# Altium schematic sheet SD CARD.SchDoc: microSD Interface
size A4; CompanyName: Atrotech; DrawnBy: Parsa Malekpour; Organization: Atrotech co.; Address1: +98 9036922999; Address2: atrotech.ir; DocumentNumber: 8; Revision: 1.0; SheetNumber: 8; SheetTotal: 10
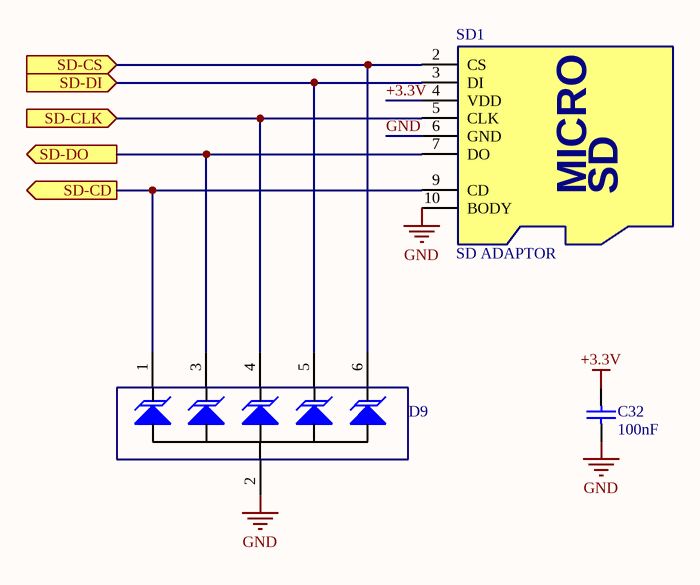
[diagram p0: SD CARD.SchDoc]

## Parts
C32  100nF  [C603]
D9  SMF05C  [SOT-363]  (value not drawn)
SD1  SD ADAPTOR  [MICRO-SD]

## Ports
SD-CD (out), SD-CLK (in), SD-CS (in), SD-DI (in), SD-DO (out)

## Nets
+3.3V: C32.2 SD1.4(VDD)
GND: C32.1 D9.2(A) SD1.6(GND) SD1.10(BODY)
SD-CD: D9.1(K) SD1.9(CD) ; port SD-CD
SD-CLK: D9.4(K) SD1.5(CLK) ; port SD-CLK
SD-CS: D9.6(K) SD1.2(CS) ; port SD-CS
SD-DI: D9.5(K) SD1.3(DI) ; port SD-DI
SD-DO: D9.3(K) SD1.7(DO) ; port SD-DO

Not connected (* = marked no-connect by the designer): SD1 1(DAT2) 8(DAT1)

## Notes on the sheet
- Title
- Size:
- Date:
- A4
- Number:
- Time:
- Revision:
- Sheet
- of
- Atrotech co.
- www.atrotech.ir <http://www.atrotech.ir>
- +98 90 369 22 999
- Tehran
- IRAN
- File:
- (in symbol uSD) MICRO; SD

## Library data of the parts
C32 = Cap: Capacitor; Designer: Parsa Malekpour; Value: 100nF
D9 = SMF05C: TVS Diode Array  For ESD and Latch-Up Protection
SD1 = uSD: uSD ADAPTOR; Designer: Parsa Malekpour; Email: malekpour.parsa@Gmail.com; weblog: p-malekpour.blogfa.com